# EAGLE design space_invaders_board (EAGLE 7.5.0)
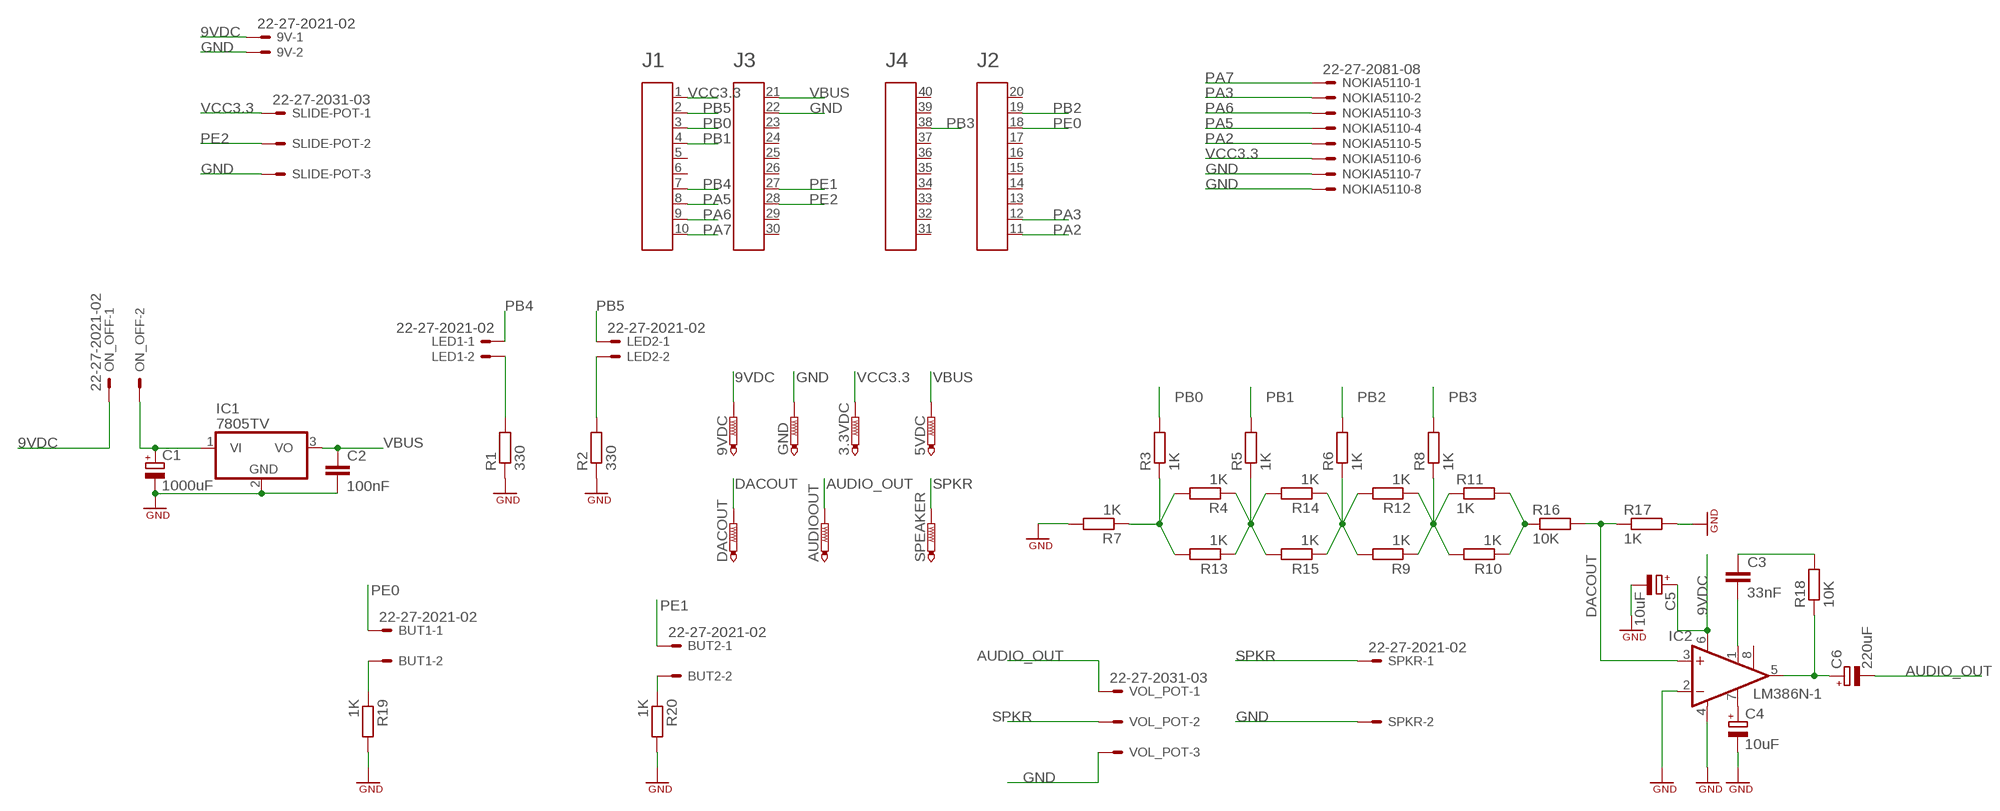
[diagram p0: schematic, sheet 1]

## Parts
3.3VDC  PTR1PAD1-13  [P1-13]
5VDC  PTR1PAD1-13  [P1-13]
9V  22-27-2021-02  [6410-02]
9VDC  PTR1PAD1-13  [P1-13]
AUDIOOUT  PTR1PAD1-13  [P1-13]
BUT1  22-27-2021-02  [6410-02]
BUT2  22-27-2021-02  [6410-02]
C1  1000uF  CPOL-EUE5-10.5  [E5-10,5]
C2  100nF  C-EU025-025X050  [C025-025X050]
C3  33nF  C2,5-3  [C2.5-3]
C4  10uF  CPOL-EUE2,5-6E  [E2,5-6E]
C5  10uF  CPOL-EUE2,5-6E  [E2,5-6E]
C6  220uF  CPOL-EUE2.5-7  [E2,5-7]
DACOUT  PTR1PAD1-13  [P1-13]
GND  PTR1PAD1-13  [P1-13]
IC1  7805TV  [TO220V]
IC2  LM386N-1  [DIL08]
LED1  22-27-2021-02  [6410-02]
LED2  22-27-2021-02  [6410-02]
NOKIA5110  22-27-2081-08  [6410-08]
ON_OFF  22-27-2021-02  [6410-02]
R1  330  R-EU_0207/15  [0207/15]
R2  330  R-EU_0207/15  [0207/15]
R3  1K  R-EU_0207/15  [0207/15]
R4  1K  R-EU_0207/15  [0207/15]
R5  1K  R-EU_0207/15  [0207/15]
R6  1K  R-EU_0207/15  [0207/15]
R7  1K  R-EU_0207/15  [0207/15]
R8  1K  R-EU_0207/15  [0207/15]
R9  1K  R-EU_0207/15  [0207/15]
R10  1K  R-EU_0207/15  [0207/15]
R11  1K  R-EU_0207/15  [0207/15]
R12  1K  R-EU_0207/15  [0207/15]
R13  1K  R-EU_0207/15  [0207/15]
R14  1K  R-EU_0207/15  [0207/15]
R15  1K  R-EU_0207/15  [0207/15]
R16  10K  R-EU_0207/15  [0207/15]
R17  1K  R-EU_0207/15  [0207/15]
R18  10K  R-EU_0207/15  [0207/15]
R19  1K  R-EU_0207/15  [0207/15]
R20  1K  R-EU_0207/15  [0207/15]
SLIDE-POT  22-27-2031-03  [6410-03]
SPEAKER  PTR1PAD1-13  [P1-13]
SPKR  22-27-2021-02  [6410-02]
TIVAC_HEADER  0  HEADER4X10-BOOSTERPACK  [4X10-BOOSTERPACK]
VOL_POT  22-27-2031-03  [6410-03]

## Nets
9VDC [9VDC]: 9V.1 9VDC.TP C5.+ IC2.6(VS) ON_OFF.1
AUDIO_OUT [AUDIO_OUT]: AUDIOOUT.TP C6.- VOL_POT.1
DACOUT: DACOUT.TP IC2.3(+IN) R16.2 R17.1
GND [GND]: 9V.2 C1.- C2.2 C4.- C5.- GND.TP IC1.2(GND) IC2.2(-IN) IC2.4(GND) NOKIA5110.7 NOKIA5110.8 R1.1 R2.1 R7.2 R17.2 R19.2 R20.2 SLIDE-POT.3 SPKR.2 TIVAC_HEADER.22 VOL_POT.3
N$2: R3.1 R4.2 R7.1 R13.2
N$3: R4.1 R5.1 R13.1 R14.2 R15.2
N$4: C3.2 IC2.1(GAIN)
N$5: LED1.2 R1.2
N$6: LED2.2 R2.2
N$7: R6.1 R9.2 R12.2 R14.1 R15.1
N$8: R8.1 R9.1 R10.2 R11.1 R12.1
N$9: R10.1 R11.2 R16.1
N$11: C3.1 R18.2
N$12: C6.+ IC2.5(OUT) R18.1
N$13: C4.+ IC2.7(BYPASS)
N$15: C1.+ IC1.1(VI) ON_OFF.2
N$16: BUT1.2 R19.1
N$17: BUT2.2 R20.1
PA2: NOKIA5110.5 TIVAC_HEADER.11
PA3: NOKIA5110.2 TIVAC_HEADER.12
PA5: NOKIA5110.4 TIVAC_HEADER.8
PA6: NOKIA5110.3 TIVAC_HEADER.9
PA7: NOKIA5110.1 TIVAC_HEADER.10
PB0: R3.2 TIVAC_HEADER.3
PB1: R5.2 TIVAC_HEADER.4
PB2: R6.2 TIVAC_HEADER.19
PB3: R8.2 TIVAC_HEADER.38
PB4: LED1.1 TIVAC_HEADER.7
PB5: LED2.1 TIVAC_HEADER.2
PE0: BUT1.1 TIVAC_HEADER.18
PE1: BUT2.1 TIVAC_HEADER.27
PE2: SLIDE-POT.2 TIVAC_HEADER.28
SPKR: SPEAKER.TP SPKR.1 VOL_POT.2
VBUS [VBUS]: 5VDC.TP C2.1 IC1.3(VO) TIVAC_HEADER.21
VCC3.3 [VCC3.3]: 3.3VDC.TP NOKIA5110.6 SLIDE-POT.1 TIVAC_HEADER.1
Unconnected: IC2.8(GAIN) TIVAC_HEADER.5 TIVAC_HEADER.6 TIVAC_HEADER.13 TIVAC_HEADER.14 TIVAC_HEADER.15 TIVAC_HEADER.16 TIVAC_HEADER.17 TIVAC_HEADER.20 TIVAC_HEADER.23 TIVAC_HEADER.24 TIVAC_HEADER.25 TIVAC_HEADER.26 TIVAC_HEADER.29 TIVAC_HEADER.30 TIVAC_HEADER.31 TIVAC_HEADER.32 TIVAC_HEADER.33 TIVAC_HEADER.34 TIVAC_HEADER.35 TIVAC_HEADER.36 TIVAC_HEADER.37 TIVAC_HEADER.39 TIVAC_HEADER.40

## Library data of the parts
3.3VDC 5VDC 9VDC AUDIOOUT DACOUT GND SPEAKER = testpad:PTR1: TEST PIN
9V BUT1 BUT2 LED1 LED2 ON_OFF SPKR = con-molex:22-?-02: CONNECTOR wire to board 2.54 mm (.1 inch) pitch header; OC_FARNELL: unknown; OC_NEWARK: unknown
C1 = resistor:CPOL-EU: POLARIZED CAPACITOR, European symbol
C2 = rcl:C-EU: CAPACITOR, European symbol
C3 = capacitor-wima:C: CAPACITOR naming: grid - package width
C4-C6 = rcl:CPOL-EU: POLARIZED CAPACITOR, European symbol
IC1 = linear:78*: Positive VOLTAGE REGULATOR Source: http://cache.national.com/ds/LM/LM78L05.pdf http://www.fairchildsemi.com/ds/LM/LM7805.pdf
IC2 = linear:LM386?-*: Low Voltage Audio Power Amplifier Source: http://cache.national.com/ds/LM/LM386.pdf
NOKIA5110 = con-molex:22-?-08: CONNECTOR wire to board 2.54 mm (.1 inch) pitch header; OC_FARNELL: unknown; OC_NEWARK: unknown
R1-R17 R19 R20 = resistor:R-EU_: RESISTOR, European symbol
R18 = rcl:R-EU_: RESISTOR, European symbol
SLIDE-POT VOL_POT = con-molex:22-?-03: CONNECTOR wire to board 2.54 mm (.1 inch) pitch header; OC_FARNELL: unknown; OC_NEWARK: unknown
TIVAC_HEADER = EAGLE_BoosterPack_Library:HEADER4X10-BOOSTERPACK

## Net classes
0 default: width 0.305 mm
1 GND: width 0.305 mm
2 9VDC: width 0.305 mm
3 VBUS: width 0.305 mm
4 VCC3.3: width 0.305 mm
5 AUDIO_OUT: width 0.305 mm

## Board
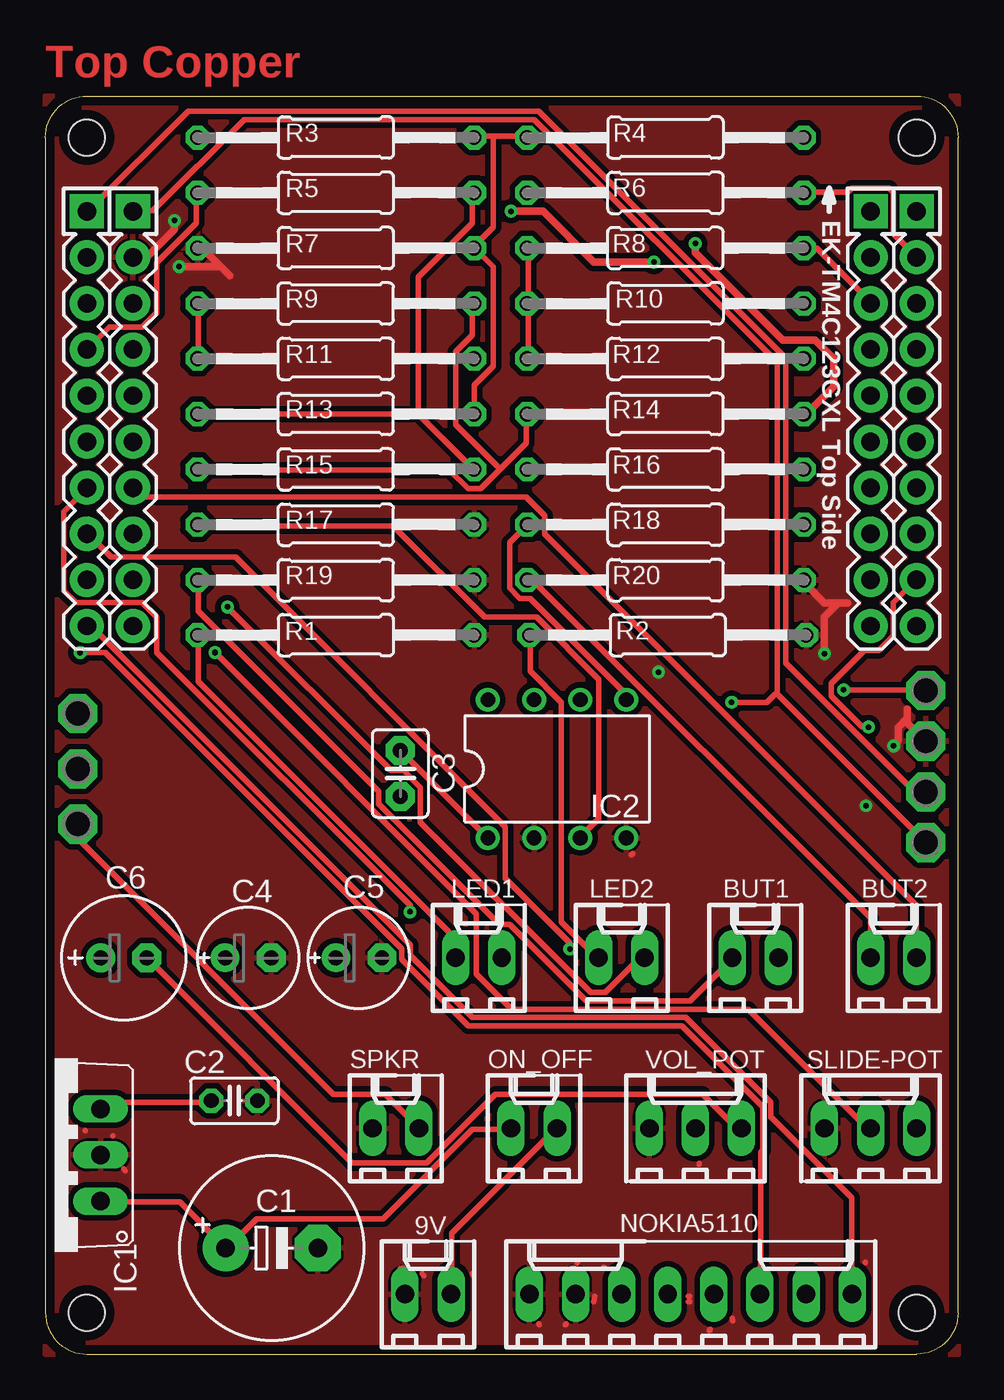
[diagram p1: board, top side]
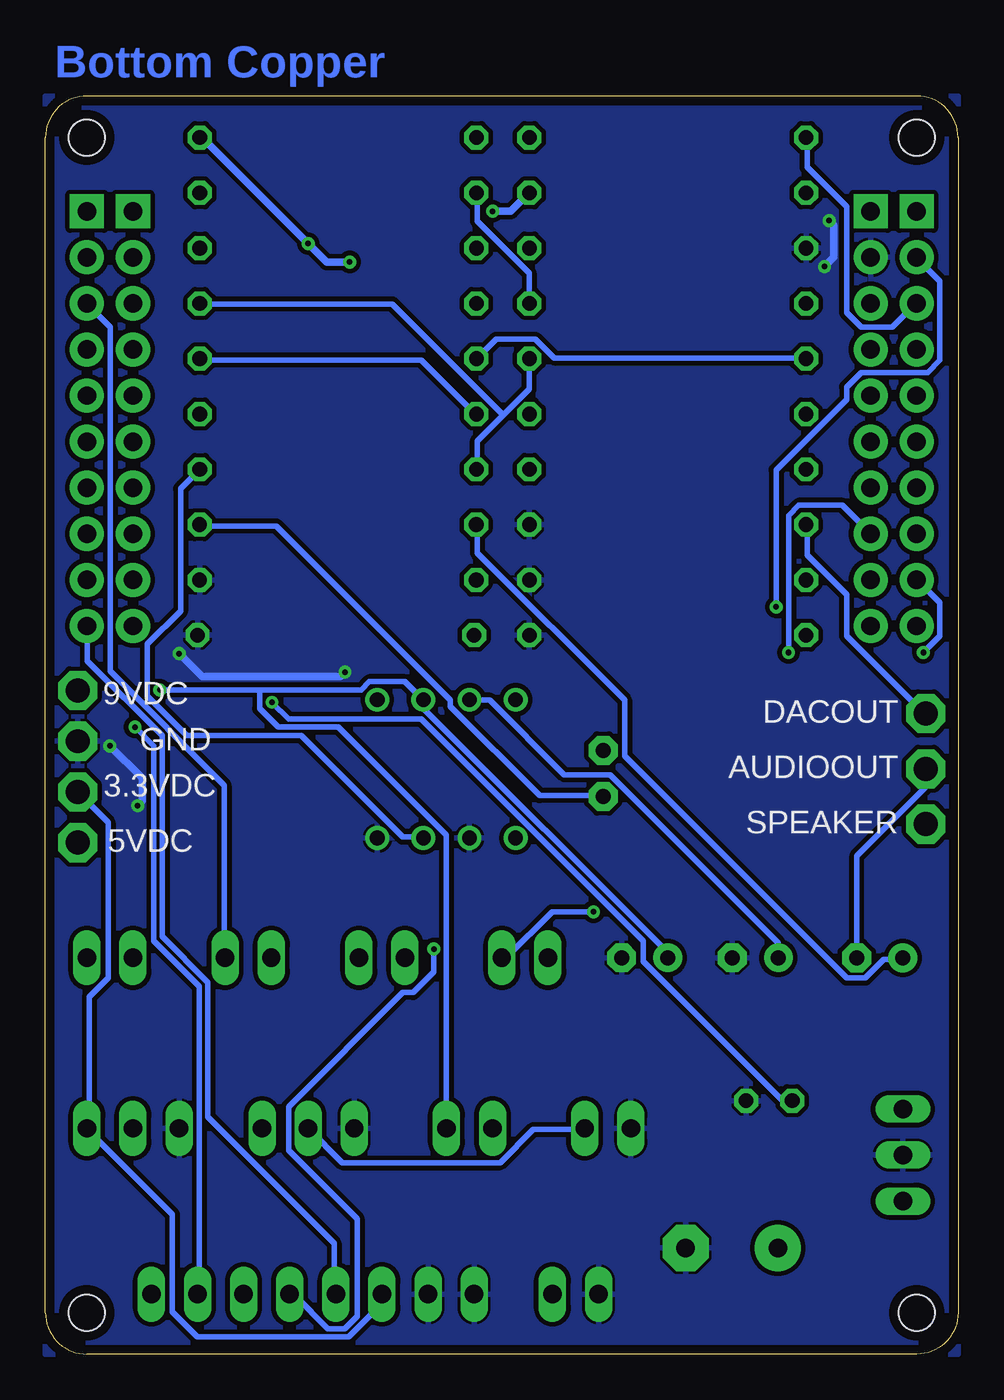
[diagram p2: board, bottom side, seen from below]

Size 50.29 x 69.34 mm. Coordinates in mm from the lower left corner, seen from the top.
Outline: 50.29,2.29 50.29,67.06 arc90 48.01,69.34 2.29,69.34 arc90 0,67.06 0,2.29 arc90 2.29,0 48.01,0 arc90 50.29,2.29
Copper layers (1*16): Top 0.035mm / dielectric 1.5mm / Bottom 0.035mm
Design rules "NYAKARUHAZ_StandardNYAK": minimum track width 6mil, minimum drill 12mil, track to track 6mil, track to pad 6mil, pad to pad 6mil, via to via 6mil, smd to smd 6mil, copper to edge 20mil, drill to drill 8mil, minimum pad ring 10mil, minimum via ring 8mil, stop-mask expansion 4mil, vias tented up to drill 0mil, thermal gap 6mil
Holes 2 mm at 48.01,2.29 2.29,2.29 2.29,67.06 48.01,67.06

### Footprints (pad centres in the part's own frame; a part is rotated, then mirrored left to right if it is on the bottom)
P1-13 = drill 1.321 pad 2.159 octagon: TP 0,0
6410-02 = drill 1.016 long: 1 1.27,0; 2 -1.27,0
E5-10,5 = drill 1.016 pad 2.54: + -2.54,0 | drill 1.016 pad 2.54 octagon: - 2.54,0
C025-025X050 = drill 0.813 octagon: 1 -1.27,0; 2 1.27,0
C2.5-3 = drill 0.813 pad 1.6 octagon: 1 -1.27,0; 2 1.27,0
E2,5-6E = drill 0.813 pad 1.575: + -1.27,0 | drill 0.813 pad 1.575 octagon: - 1.27,0
E2,5-7 = drill 0.813 pad 1.6: + -1.27,0 | drill 0.813 pad 1.6 octagon: - 1.27,0
TO220V = drill 1.016 long: 1 -2.54,-2.54; 2 0,-2.54; 3 2.54,-2.54
DIL08 = drill 0.813 pad 1.27: 1 -3.81,-3.81; 2 -1.27,-3.81; 3 1.27,-3.81; 4 3.81,-3.81; 5 3.81,3.81; 6 1.27,3.81; 7 -1.27,3.81; 8 -3.81,3.81
6410-08 = drill 1.016 long: 1 8.89,0; 2 6.35,0; 3 3.81,0; 4 1.27,0; 5 -1.27,0; 6 -3.81,0; 7 -6.35,0; 8 -8.89,0
0207/15 = drill 0.813 octagon: 1 -7.62,0; 2 7.62,0
6410-03 = drill 1.016 long: 1 2.54,0; 2 0,0; 3 -2.54,0
4X10-BOOSTERPACK = drill 1.016 pad 1.88 square: 1 0,10.16; 20 45.72,10.16; 21 2.54,10.16; 40 43.18,10.16 | drill 1.016 pad 1.88: 2 0,7.62; 3 0,5.08; 4 0,2.54; 5 0,0; 6 0,-2.54; 7 0,-5.08; 8 0,-7.62; 9 0,-10.16; 10 0,-12.7; 11 45.72,-12.7; 12 45.72,-10.16; 13 45.72,-7.62; 14 45.72,-5.08; 15 45.72,-2.54; 16 45.72,0; 17 45.72,2.54; 18 45.72,5.08; 19 45.72,7.62; 22 2.54,7.62; 23 2.54,5.08; 24 2.54,2.54; 25 2.54,0; 26 2.54,-2.54; 27 2.54,-5.08; 28 2.54,-7.62; 29 2.54,-10.16; 30 2.54,-12.7; 31 43.18,-12.7; 32 43.18,-10.16; 33 43.18,-7.62; 34 43.18,-5.08; 35 43.18,-2.54; 36 43.18,0; 37 43.18,2.54; 38 43.18,5.08; 39 43.18,7.62

### Placement (x,y rotation side)
3.3VDC  48.51,30.99 0 top
5VDC  48.51,28.19 0 top
9V  21.08,3.3 0 top
9VDC  48.51,36.58 0 top
AUDIOOUT  1.78,32.26 0 top
BUT1  39.12,21.84 0 top
BUT2  46.74,21.84 0 top
C1  12.48,5.85 0 top
C2  10.41,13.97 0 top
C3  19.56,32 90 top
C4  11.18,21.84 0 top
C5  17.27,21.84 0 top
C6  4.32,21.84 0 top
DACOUT  1.78,35.31 0 top
GND  48.51,33.78 0 top
IC1  0.5,10.97 90 top
IC2  28.19,32.26 0 top
LED1  23.88,21.84 0 top
LED2  31.75,21.84 0 top
NOKIA5110  35.56,3.3 0 top
ON_OFF  26.92,12.45 0 top
R1  16,39.62 180 top
R2  34.29,39.62 180 top
R3  16,67.06 180 top
R4  34.16,67.06 180 top
R5  16,64.01 180 top
R6  34.16,64.01 0 top
R7  16,60.96 180 top
R8  34.16,60.96 0 top
R9  16,57.91 0 top
R10  34.16,57.91 180 top
R11  16,54.86 0 top
R12  34.16,54.86 0 top
R13  16,51.82 0 top
R14  34.16,51.82 0 top
R15  16,48.77 0 top
R16  34.16,48.77 0 top
R17  16,45.72 0 top
R18  34.17,45.72 0 top
R19  16,42.66 0 top
R20  34.17,42.66 0 top
SLIDE-POT  45.47,12.45 0 top
SPEAKER  1.78,29.21 0 top
SPKR  19.3,12.45 0 top
TIVAC_HEADER  2.29,52.83 0 top
VOL_POT  35.81,12.45 0 top

### Tracks (layer width: path | path; a pad name or v marks a point on that pad's centre or on a via)
9VDC  (via drill 0.3 pad 0.3)
  Top 0.305: 9V.1 22.38,3.35 22.38,6.67 28.09,12.38 ON_OFF.1 | v43.98,36.61 48.44,36.61 9VDC.TP
  Bottom 0.305: C5.+ 16.09,21.87 16.09,22.21 29.46,35.59 IC2.6 29.58,36.16 30.49,37.07 32.44,37.07 32.89,36.61 38.49,36.61 | 38.49,36.61 v43.98,36.61 | 38.49,36.61 38.49,35.59 37.47,34.56 34.15,34.56 28.21,28.61 28.21,12.5 ON_OFF.1
AUDIO_OUT
  Top 0.305: VOL_POT.1 38.27,12.5 38.04,12.5 36.21,14.33 24.78,14.33 21.01,10.55 16.89,10.55 5.69,21.75 C6.-
  Bottom 0.305: AUDIOOUT.TP 1.8,32.16 1.8,31.24 5.57,27.47 5.57,21.87 C6.-
DACOUT
  Top 0.305: R17.1 8.43,45.64 19.18,45.64 24.21,40.62 27.06,40.62 30.49,37.19 30.49,29.53 29.46,28.5 IC2.3
  Bottom 0.305: R17.1 8.32,45.64 8.32,44.04 6.15,41.87 6.15,39.59 1.8,35.24 DACOUT.TP | IC2.3 29.46,28.5 30.61,28.5 36.21,34.1 42.49,34.1 44.67,36.27 44.67,39.13 42.84,40.96 42.84,47.7 41.81,48.73 R16.2
GND  (via drill 0.3 pad 0.3)
  Top 0.305: 35.41,2.9 35.51,2.9 | 29.01,4.72 29.11,4.72 | 37.85,1.98 37.86,1.85 | 28.7,1.68 28.65,1.63 | 23.52,4.42 23.57,4.31 | 20.78,4.42 20.85,4.31 | 1.88,10.82 1.88,10.87 | 36.02,10.52 36.02,10.47 | 4.32,10.21 4.4,10.09 | 3.71,12.04 | 32.36,27.58 32.29,27.52 | 32.05,28.5 31.95,28.4 | 45.16,5.03 45.19,5.05 | 27.18,1.68 27.21,1.62 | 46.38,13.87 46.5,13.9 | 35.41,3.2 35.51,3.2 | 29.31,5.03 29.33,5.13 | 36.63,1.37 36.59,1.32 | 30.23,2.9 30.28,3.2 | 19.56,4.72 19.71,4.72 | 2.18,12.34 2.18,12.29 | 30.84,4.72 30.76,4.8 | 19.86,3.51 9V.2 | 29.31,3.2
  Top 0.406: 9.65,59.94 8.64,60.96 R7.2 | 9.65,59.94 10.16,59.44 | v7.37,59.94 9.65,59.94 | v7.11,62.48 7.11,61.98 5.59,60.45 TIVAC_HEADER.22 | 47.5,35.05 47.5,34.8 GND.TP | 47.5,35.05 47.5,35.56 | 47.5,35.05 46.99,34.54 46.99,33.78 v46.74,33.53 | 43.69,41.4 42.93,41.4 41.91,42.42 R20.2 | 43.69,41.4 44.2,41.4 | 43.69,41.4 42.93,40.64 v42.93,38.61
  Bottom 0.406: v7.37,59.94 6.86,60.45 6.86,62.23 v7.11,62.48 | v46.74,33.53 44.96,31.75 44.96,30.48 v45.21,30.23 | v42.93,38.61 41.66,37.34 34.04,37.34 v33.78,37.59
  pour Top (isolate 0.305): 0,69.34 50.29,69.34 50.29,0 0,0
  pour Bottom (isolate 0.254): 0,69.34 50.29,69.34 50.29,0 0,0
N$2
  Top 0.305: 24.66,67.13 26.49,67.13 R4.2 | 24.66,67.13 23.63,67.13 R3.1 | R13.2 23.63,53.42 24.66,54.45 24.66,59.93 R7.1 23.63,61.07 24.66,62.1 24.66,67.13
N$3  (via drill 0.3 pad 0.3)
  Top 0.305: 20.55,51.82 R13.1 | 20.55,51.82 23.52,48.84 R15.2 | 20.55,51.82 20.55,59.36 23.52,62.33 23.52,63.93 R5.1
  Top 0.406: v33.53,60.2 30.23,60.2 27.43,62.99 v25.65,62.99 | v35.81,61.21 35.81,60.71 40.64,55.88 42.42,55.88 43.43,54.86 43.43,53.34 41.91,51.82 R14.2
  Bottom 0.406: v33.53,60.2 34.8,60.2 v35.81,61.21 41.66,67.06 R4.1 | v25.65,62.99 24.64,62.99 R5.1
N$4
  Top 0.305: IC2.1 24.32,28.5 19.63,33.18 C3.2
N$5
  Top 0.305: LED1.2 22.61,22.9 8.43,37.07 8.43,39.59 R1.2
N$6
  Top 0.305: R2.2 26.72,39.59 26.72,37.64 28.43,35.93 28.43,23.81 30.38,21.87 LED2.2
N$7
  Top 0.305: 25.06,48.79 26.49,50.22 26.49,51.82 R14.1 | 25.06,48.79 23.98,47.7 23.29,47.7 22.26,48.73 8.43,48.73 R15.1 | 25.06,48.79 22.61,51.24 22.61,55.24 23.52,56.16 23.52,57.87 R9.2
  Bottom 0.305: R9.2 23.63,57.99 23.63,59.59 26.49,62.45 26.49,63.93 R6.1 | R12.2 41.69,54.79 29.58,54.79 26.61,51.82 R14.1
N$8
  Top 0.305: R11.1 8.43,54.9 8.43,57.87 R9.1 | R12.1 26.61,54.9 26.61,57.87 R10.2 26.61,57.99 26.61,60.96 R8.1
  Bottom 0.305: R11.1 8.43,54.9 22.26,54.9 23.29,55.93 25.46,55.93 26.49,54.9 R12.1
N$9
  Bottom 0.305: 25.06,51.76 26.49,50.33 26.49,48.84 R16.1 | 25.06,51.76 23.63,53.19 23.63,54.79 R11.2 | 25.06,51.76 31.18,57.87 41.69,57.87 R10.1
N$11
  Bottom 0.305: R18.2 41.69,45.64 37.58,45.64 27.98,36.04 27.98,35.7 23.06,30.78 19.63,30.78 C3.1
N$12
  Top 0.305: IC2.5 31.98,36.16 31.98,36.39 26.72,41.64 26.15,41.64 25.58,42.21 25.58,44.73 26.49,45.64 R18.1
  Bottom 0.305: C6.+ 3.06,21.75 4.09,21.75 5.12,20.73 6.15,20.73 18.38,32.96 18.38,36.04 26.49,44.16 26.49,45.64 R18.1
N$13
  Bottom 0.305: IC2.7 26.83,36.04 25.81,36.04 21.69,31.93 19.18,31.93 9.92,22.67 9.92,21.87 C4.+
N$15
  Top 0.305: IC1.1 3.06,8.38 7.4,8.38 9.92,5.87 C1.+ 10.03,5.87 11.63,7.47 18.61,7.47 23.52,12.38 25.58,12.38 ON_OFF.2
N$16
  Top 0.305: R19.1 8.43,42.56 8.43,40.96 18.38,31.01 18.38,30.33 25.01,23.7 25.58,23.7 29.81,19.47 35.52,19.47 37.81,21.75 BUT1.2
N$17
  Top 0.305: BUT2.2 45.47,24.04 26.95,42.56 26.61,42.56 R20.1
PA2
  Bottom 0.305: NOKIA5110.5 34.38,3.35 34.38,6.1 41.35,13.07 41.35,20.5 43.87,23.01 43.87,34.1 47.98,38.21 47.98,40.04 TIVAC_HEADER.11
PA3  (via drill 0.3 pad 0.3)
  Top 0.305: v45.35,34.56 45.01,34.56 43.29,36.27 43.29,36.96 45.12,38.79 45.92,38.79 46.72,39.59 46.72,41.41 47.98,42.67 TIVAC_HEADER.12
  Bottom 0.305: v45.35,34.56 44.32,33.53 44.32,22.78 41.81,20.27 41.81,3.35 NOKIA5110.2
PA5  (via drill 0.3 pad 0.3)
  Top 0.305: v28.89,22.33 28.89,22.67 25.35,26.21 25.35,29.07 10.49,43.93 3.63,43.93 2.38,45.19 TIVAC_HEADER.8
  Bottom 0.305: v28.89,22.33 28.89,21.07 30.04,19.93 30.61,19.93 36.89,13.64 36.89,11.24 33.12,7.47 33.12,2.1 33.81,1.41 34.72,1.41 36.55,3.24 36.78,3.24 NOKIA5110.4
PA6  (via drill 0.3 pad 0.3)
  Top 0.305: v1.92,38.67 3.29,38.67 19.63,22.33 19.63,21.75 23.29,18.1 35.07,18.1 39.52,13.64 39.52,11.24 39.41,11.13 39.41,3.35 NOKIA5110.3
  Bottom 0.305: v1.92,38.67 1,39.59 1,41.41 2.26,42.67 TIVAC_HEADER.9
PA7
  Top 0.305: NOKIA5110.1 44.44,3.35 44.44,8.61 39.98,13.07 39.98,13.87 35.29,18.55 23.52,18.55 20.09,21.98 20.09,22.55 2.6,40.04 2.38,40.04 TIVAC_HEADER.10
PB0
  Bottom 0.305: R3.2 8.32,67.02 8.32,65.42 6.15,63.25 6.15,57.42 5.35,56.62 3.63,56.62 2.38,57.87 TIVAC_HEADER.3
PB1
  Top 0.305: R5.2 8.32,63.93 8.32,62.33 6.15,60.16 6.15,57.42 5.35,56.62 3.52,56.62 2.38,55.47 TIVAC_HEADER.4
PB2
  Top 0.305: R6.2 41.81,64.05 44.21,64.05 44.44,64.28 46.5,64.28 46.72,64.05 46.72,61.76 47.98,60.5 TIVAC_HEADER.19
PB3
  Top 0.305: R8.2 42.49,60.96 45.47,57.99 TIVAC_HEADER.38
PB4  (via drill 0.3 pad 0.3)
  Top 0.305: v20.09,24.38 20.09,24.73 6.15,38.67 6.15,40.62 5.35,41.41 1.69,41.41 1,42.1 1,46.44 2.26,47.7 TIVAC_HEADER.7
  Bottom 0.305: v20.09,24.38 22.38,24.38 24.89,21.87 25.12,21.87 LED1.1
PB5  (via drill 0.3 pad 0.3)
  Top 0.305: v10.03,41.19 19.06,32.16 19.75,32.16 20.66,31.24 20.66,29.3 30.04,19.93 30.84,19.93 32.66,21.75 33.01,21.75 LED2.1
  Bottom 0.305: v10.03,41.19 10.03,48.73 6.15,52.62 6.15,53.3 5.35,54.1 1.69,54.1 1,54.79 1,59.13 2.26,60.39 TIVAC_HEADER.2
PE0
  Bottom 0.305: BUT1.1 40.44,21.87 40.44,31.36 46.72,37.64 46.72,56.62 47.98,57.87 TIVAC_HEADER.18
PE1
  Top 0.305: BUT2.1 47.98,21.87 47.98,24.73 27.52,45.19 27.52,46.21 26.49,47.24 5.35,47.24 4.89,47.7 TIVAC_HEADER.27
PE2  (via drill 0.3 pad 0.3)
  Top 0.305: v9.35,38.67 23.75,24.27 23.75,20.95 25.69,19.01 38.72,19.01 45.24,12.5 45.47,12.5 SLIDE-POT.2
  Bottom 0.305: v9.35,38.67 9.35,46.21 8.78,46.79 6.38,46.79 4.89,45.3 TIVAC_HEADER.28
SPKR
  Top 0.305: SPEAKER.TP 1.8,29.18 1.8,28.38 15.86,14.33 18.72,14.33 20.55,12.5 SPKR.1
  Bottom 0.305: VOL_POT.2 33.92,10.55 25.23,10.55 23.41,12.38 20.66,12.38 SPKR.1
VBUS  (via drill 0.3 pad 0.3)
  Top 0.305: C2.1 9.12,13.87 3.4,13.87 3.06,13.53 IC1.3 | 40.32,36.39 40.32,54.67 26.95,68.05 10.95,68.05 5.92,63.02 4.89,63.02 TIVAC_HEADER.21 | 5VDC.TP 40.32,36.39 | v37.81,35.93 39.75,35.93 40.21,36.39 40.32,36.39
  Bottom 0.305: v37.81,35.93 36.89,35.01 29.58,35.01 17.35,22.78 17.35,21.64 9.69,13.98 9.23,13.98 C2.1
VCC3.3
  Top 0.305: TIVAC_HEADER.1 2.38,63.02 7.86,68.5 27.18,68.5 40.78,54.9 40.78,38.1 47.87,31.01 48.44,31.01 3.3VDC.TP
  Bottom 0.305: NOKIA5110.6 31.75,2.78 33.58,0.95 41.92,0.95 43.29,2.32 43.29,7.7 47.98,12.38 SLIDE-POT.1 47.87,12.5 47.87,19.7 46.84,20.73 46.84,29.3 48.44,30.9 3.3VDC.TP

### Text on the board
Top: Top Copper
Bottom: Bottom Copper
tPlace: EK-TM4C123GXL Top Side